# Altium schematic sheet Main.SchDoc: Breakout 10pin
size A3; Organization: INTERCREATE; Address1: 2415 3RD ST. SUITE #232; Address2: SAN FRANCISCO CA 94107; SheetNumber: 1; SheetTotal: 1; ProjectName: KAGWERKS COMMAND CENTER
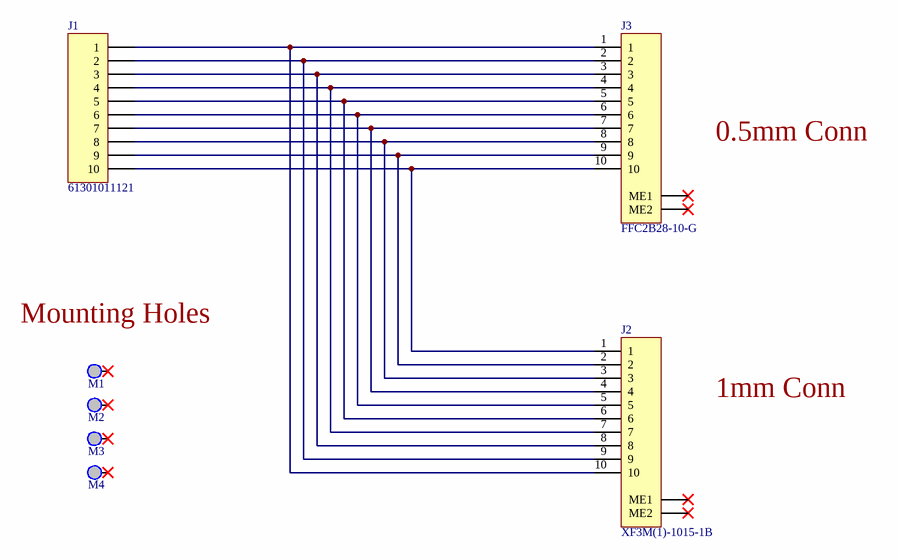
[diagram p0: Main.SchDoc]

## Parts
J1  61301011121  [HDR-V-10P-2.54MM]
J2  XF3M(1)-1015-1B  [CONN-FFC-H-10P-1MM]
J3  FFC2B28-10-G  [CONN-FFC-H-10P-0.5MM]
M1  MTG_HOLE  [MH_P_2.5MM]  (value not drawn)  (no BOM)
M2  MTG_HOLE  [MH_P_2.5MM]  (value not drawn)  (no BOM)
M3  MTG_HOLE  [MH_P_2.5MM]  (value not drawn)  (no BOM)
M4  MTG_HOLE  [MH_P_2.5MM]  (value not drawn)  (no BOM)

## Nets
NetJ1_1: J1.1 J2.10 J3.1
NetJ1_2: J1.2 J2.9 J3.2
NetJ1_3: J1.3 J2.8 J3.3
NetJ1_4: J1.4 J2.7 J3.4
NetJ1_5: J1.5 J2.6 J3.5
NetJ1_6: J1.6 J2.5 J3.6
NetJ1_7: J1.7 J2.4 J3.7
NetJ1_8: J1.8 J2.3 J3.8
NetJ1_9: J1.9 J2.2 J3.9
NetJ1_10: J1.10 J2.1 J3.10

Not connected (* = marked no-connect by the designer): J2 ME1* ME2*; J3 ME1* ME2*; M1 1*; M2 1*; M3 1*; M4 1*

## Notes on the sheet
- 0.5mm Conn
- (near M1) Mounting Holes
- 1mm Conn
- Title
- Size:
- Date:
- A3
- Number:
- Time:
- Revision:
- Sheet
- of
- File:

## Library data of the parts
J1 = HDR-V-1X10-M-2.54MM: THT Vertical Pin Header WR-PHD, Pitch 2.54 mm, Single Row, 10 pins; Manufacturer 1: Wurth Electronics; Current Rating: 3A; Voltage Rating: 250V; Number of Positions: 10; Insulation Resistance: 1GR; Gender: Male; Pitch: 2.54mm; Supplier: Newark; Supplier Part Number: 16T0627; Manufacturer Part Number 1: 61301011121; RoHS: Yes; Category: Headers and Wire Housings; Stock: 997; Pricing: 1=0.65, 10=0.65, 25=0.65, 50=0.65, 100=0.6 (USD); Mounting Technology: Through Hole; Contact Plating: Gold; Contact Material: Copper Alloy,Copper; Color: Black; Housing Material: PBT; Contact Shape: Square; Contact Finish - Mating: GOLD; Insulation Material: Nylon; Insulation Color: Black; Min Operating Temperature: -40°C; Max Operating Temperature: 105°C; Number of Rows: 1; Packaging: Bulk; Contact Gender: Male; Termination: Solder; Number of Contacts: 10; Orientation: Straight; Connector Type: Header; Series: WR-PHD; Contact Type: Male Pin; Fastening Type: Pull; Length: 2.54mm; Width: 25.4mm; Height: 11.54mm; Flammability Rating: UL94 V-0; RoHS Compliant: Yes; Reach SVHC Compliant: Unknown; ComponentLink1URL: https://datasheet.ciiva.com/738/6130xx11121-738550.pdf?src-supplier=Digi-Key; ComponentLink1Description: https://datasheet.ciiva.com/738/6130xx11121-738550.pdf?src-supplier=Digi-Key; ComponentLink2URL: https://datasheet.ciiva.com/7631/1442175-7631321.pdf?src-supplier=Element14; ComponentLink2Description: https://datasheet.ciiva.com/7631/1442175-7631321.pdf?src-supplier=Element14; ComponentLink3URL: https://datasheet.ciiva.com/48700/001088187-da-01-en-wr-phd-tht-stiftleiste-61301011121-48700876.pdf?src-supplier=Conrad; ComponentLink3Description: https://datasheet.ciiva.com/48700/001088187-da-01-en-wr-phd-tht-stiftleiste-61301011121-48700876.pdf?src-supplier=Conrad
J2 = CONN-FFC-H-10P-1MM: 1.0-mm Pitch, Dual Contact ; For FPC/FFC, 10 Contacts, RoHS; Manufacturer 1: Omron; Actuator Material: Polymer,Liquid Crystal Polymer; Actuator Color: Black; Number of Positions: 10; Voltage Rating: 50V; Current Rating: 500mA; Mating Cycles: 20; Pitch: 0.039inch; Supplier: Arrow Electronics; Supplier Part Number: XF3M(1)-1015-1B; Manufacturer Part Number 1: XF3M(1)-1015-1B; RoHS: Yes; Category: FFC / FPC; Stock: 1; Pricing: 1=0.915, 10=0.8221, 25=0.8139, 50=0.8057, 100=0.7768, 250=0.7566, 500=0.719, 1000=0.5891 (USD); Mounting Technology: Surface Mount; Contact Material: Copper Alloy; Contact Plating: Gold; Housing Material: Polymer; Housing Color: Natural; Min Operating Temperature: -30°C; Max Operating Temperature: 85°C; Packaging: Tape and Reel; Termination: Solder; Series: XF3M; Number of Rows: 1; Number of Contacts: 10; Orientation: Right Angle; Package Quantity: 1500; Radiation Hardening: No; Flammability Rating: UL94 V-0; RoHS Compliant: Yes; ComponentLink1URL: https://datasheet.ciiva.com/48563/en-xf3m-48563769.pdf?src-supplier=Avnet; ComponentLink1Description: https://datasheet.ciiva.com/48563/en-xf3m-48563769.pdf?src-supplier=Avnet
J3 = CONN-FFC-H-10P-0.5MM: CONN, FPC, 10POS, 1ROW, 0.5MM, R/A SMT; Pitch Spacing: 0.5mm; No. of Contacts: 10Contacts; Gender: Receptacle;...; Manufacturer 1: Global Connector Technology; Supplier: Newark; Supplier Part Number: 90AJ6008; Manufacturer Part Number 1: FFC2B28-10-G; RoHS: No; Category: Connectors; Stock: 3980; Pricing: 1=0.515, 250=0.397, 500=0.357, 1000=0.325, 4000=0.325, 5000=0.298 (USD)
M1-M4 = MTG_HOLE: MTG HOLE PLATED VARIOUS SIZES